# EAGLE design SparkFun_Qwiic_Motor_Driver (EAGLE 9.5.0)
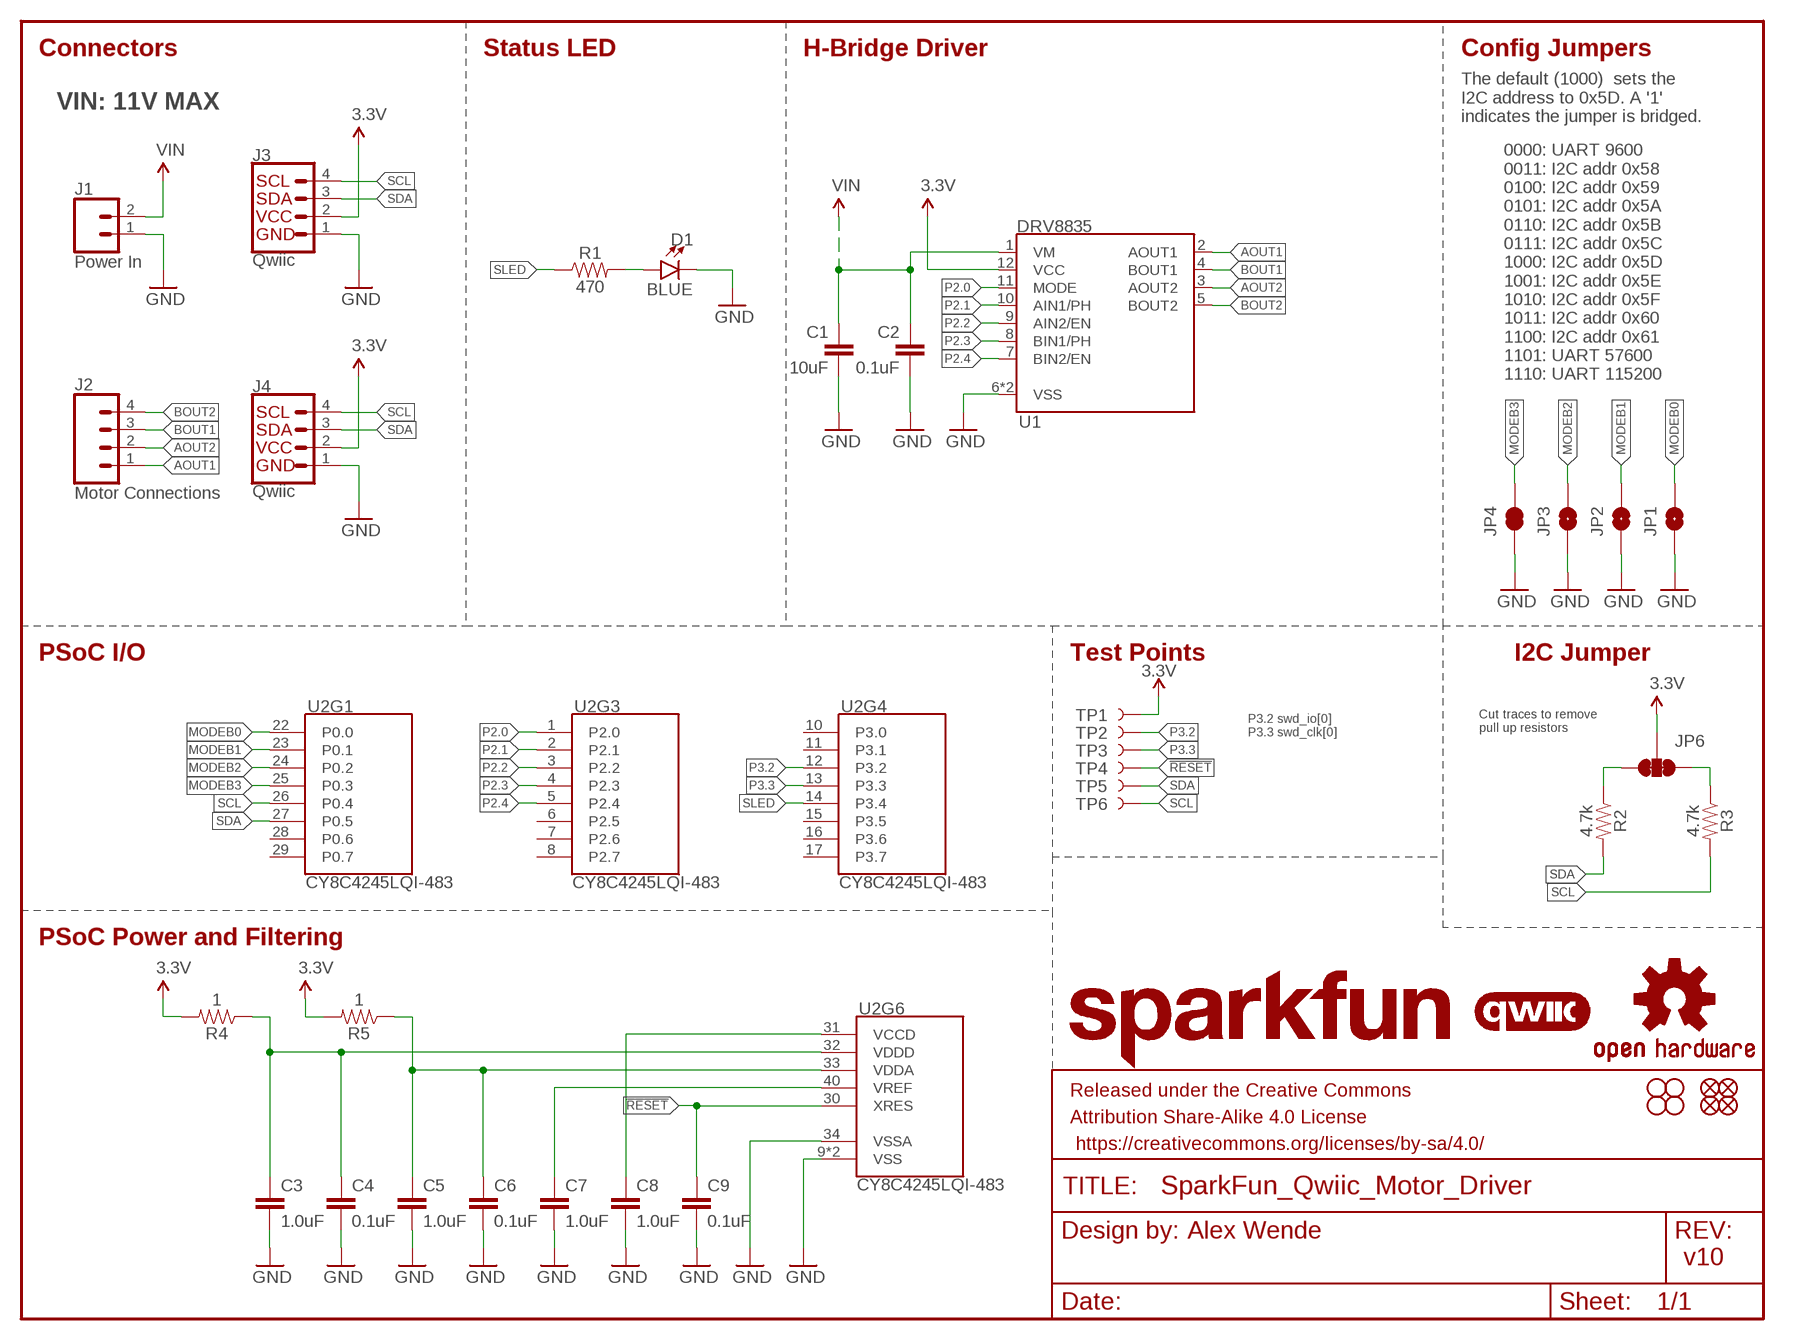
[diagram p0: schematic, sheet 1]

## Parts
C1  10uF  10UF-0805-25V-10%  [0805]
C2  0.1uF  0.1UF-0402-16V-10%  [0402]
C3  1.0uF  1.0UF-0402-16V-10%  [0402]
C4  0.1uF  0.1UF-0402-16V-10%  [0402]
C5  1.0uF  1.0UF-0402-16V-10%  [0402]
C6  0.1uF  0.1UF-0402-16V-10%  [0402]
C7  1.0uF  1.0UF-0402-16V-10%  [0402]
C8  1.0uF  1.0UF-0402-16V-10%  [0402]
C9  0.1uF  0.1UF-0402-16V-10%  [0402]
D1  BLUE  LED-BLUE0603  [LED-0603]
FD1  FIDUCIALUFIDUCIAL  [FIDUCIAL-MICRO]
FD2  FIDUCIALUFIDUCIAL  [FIDUCIAL-MICRO]
FD3  FIDUCIALUFIDUCIAL  [FIDUCIAL-MICRO]
FD4  FIDUCIALUFIDUCIAL  [FIDUCIAL-MICRO]
FRAME1  FRAME-LETTER  [CREATIVE_COMMONS]
H1  STAND-OFF  [STAND-OFF]
H2  STAND-OFF  [STAND-OFF]
H3  STAND-OFF  [STAND-OFF]
H4  STAND-OFF  [STAND-OFF]
J1  Power In  CONN_023.5MM  [SCREWTERMINAL-3.5MM-2]
J2  Motor Connections  CONN_04SCREW  [SCREWTERMINAL-3.5MM-4]
J3  Qwiic  QWIIC_CONNECTORJS-1MM  [JST04_1MM_RA]
J4  Qwiic  QWIIC_CONNECTORJS-1MM  [JST04_1MM_RA]
JP1  JUMPER-PAD-2  JUMPER-SMT_2_NO_NO-SILK  [SMT-JUMPER_2_NO_NO-SILK]
JP2  JUMPER-PAD-2  JUMPER-SMT_2_NO_NO-SILK  [SMT-JUMPER_2_NO_NO-SILK]
JP3  JUMPER-PAD-2  JUMPER-SMT_2_NO_NO-SILK  [SMT-JUMPER_2_NO_NO-SILK]
JP4  JUMPER-PAD-2  JUMPER-SMT_2_NC_TRACE_NO-SILK  [SMT-JUMPER_2_NC_TRACE_NO-SILK]
JP6  JUMPER-SMT_3_2-NC_TRACE_NO-SILK  [SMT-JUMPER_3_2-NC_TRACE_NO-SILK]
LOGO2  OSHW-LOGOMINI  [OSHW-LOGO-MINI]
LOGO3  SFE_LOGO_NAME.1_INCH  [SFE_LOGO_NAME_.1]
R1  470  470OHM-0603-1/10W-1%  [0603]
R2  4.7k  4.7KOHM-0603-1/10W-1%  [0603]
R3  4.7k  4.7KOHM-0603-1/10W-1%  [0603]
R4  1  1OHM-0603-1/10W-1%  [0603]
R5  1  1OHM-0603-1/10W-1%  [0603]
TP1  TEST-POINTTP_15TH_THRU  [TP_15TH]
TP2  TEST-POINTTP_15TH_THRU  [TP_15TH]
TP3  TEST-POINTTP_15TH_THRU  [TP_15TH]
TP4  TEST-POINTTP_15TH_THRU  [TP_15TH]
TP5  TEST-POINTTP_15TH_THRU  [TP_15TH]
TP6  TEST-POINTTP_15TH_THRU  [TP_15TH]
U1  DRV8835  DRV883X  [WSON-12]
U2  CY8C4245LQI-483  PSOC4_4200_40QFN  [QFN-40]
U$1  QWIIC_LOGO_5MM  [QWIIC_5MM]

## Nets
3.3V: J3.2 J4.2 JP6.2 R4.2 R5.2 TP1.P$1 U1.12(VCC)
!RESET: C9.1 TP4.P$1 U2.30(XRES)
AOUT1: J2.1 U1.2(AOUT1)
AOUT2: J2.2 U1.3(AOUT2)
BOUT1: J2.3 U1.4(BOUT1)
BOUT2: J2.4 U1.5(BOUT2)
GND: C1.2 C2.2 C3.2 C4.2 C5.2 C6.2 C7.2 C8.2 C9.2 D1.C J1.1 J3.1 J4.1 JP1.1 JP2.1 JP3.1 JP4.1 U1.6(VSS) U1.PAD(VSS) U2.9(VSS) U2.34(VSSA) U2.EP(VSS)
MODEB0: JP1.2 U2.22(P0.0)
MODEB1: JP2.2 U2.23(P0.1)
MODEB2: JP3.2 U2.24(P0.2)
MODEB3: JP4.2 U2.25(P0.3)
N$1: C8.1 U2.31(VCCD)
N$3: C5.1 C6.1 R5.1 U2.33(VDDA)
N$4: C7.1 U2.40(VREF)
N$10: D1.A R1.2
N$11: JP6.1 R3.1
N$12: JP6.3 R2.1
P2.0: U1.11(MODE) U2.1(P2.0)
P2.1: U1.10(AIN1/PH) U2.2(P2.1)
P2.2: U1.9(AIN2/EN) U2.3(P2.2)
P2.3: U1.8(BIN1/PH) U2.4(P2.3)
P2.4: U1.7(BIN2/EN) U2.5(P2.4)
P3.2: TP2.P$1 U2.12(P3.2)
P3.3: TP3.P$1 U2.13(P3.3)
SCL: J3.4 J4.4 R3.2 TP6.P$1 U2.26(P0.4)
SDA: J3.3 J4.3 R2.2 TP5.P$1 U2.27(P0.5)
SLED: R1.1 U2.14(P3.4)
VDDD: C3.1 C4.1 R4.1 U2.32(VDDD)
VIN: C1.1 C2.1 J1.2 U1.1(VM)
Unconnected: U2.6(P2.5) U2.7(P2.6) U2.8(P2.7) U2.10(P3.0) U2.11(P3.1) U2.15(P3.5) U2.16(P3.6) U2.17(P3.7) U2.18(P4.0) U2.19(P4.1) U2.20(P4.2) U2.21(P4.3) U2.28(P0.6) U2.29(P0.7) U2.35(P1.0) U2.36(P1.1) U2.37(P1.2) U2.38(P1.3) U2.39(P1.4)

## Notes on the sheet
- Connectors | Status LED | H-Bridge Driver | Config Jumpers
- The default (1000)  sets the 
  I2C address to 0x5D. A '1' 
  indicates the jumper is bridged.
- VIN: 11V MAX
- 0000: UART 9600
  0011: I2C addr 0x58
  0100: I2C addr 0x59
  0101: I2C addr 0x5A
  0110: I2C addr 0x5B
  0111: I2C addr 0x5C
  1000: I2C addr 0x5D
  1001: I2C addr 0x5E
  1010: I2C addr 0x5F
  1011: I2C addr 0x60
  1100: I2C addr 0x61
  1101: UART 57600
  1110: UART 115200
- PSoC I/O | Test Points | I2C Jumper
- P3.2 swd_io[0]
  P3.3 swd_clk[0]
- Cut traces to remove
  pull up resistors
- PSoC Power and Filtering
- Alex Wende
- v10

## Library data of the parts
C1 = SparkFun-Capacitors:10UF: 10.0µF ceramic capacitors A capacitor is a passive two-terminal electrical component used to store electrical energy temporarily in an electric field.; PROD_ID: CAP-14259
C2 C4 C6 C9 = SparkFun-Capacitors:0.1UF: 0.1µF ceramic capacitors A capacitor is a passive two-terminal electrical component used to store electrical energy temporarily in an electric field.; PROD_ID: CAP-12416
C3 C5 C7 C8 = SparkFun-Capacitors:1.0UF: 1µF ceramic capacitors A capacitor is a passive two-terminal electrical component used to store electrical energy temporarily in an electric field.; PROD_ID: CAP-12417
D1 = SparkFun-LED:LED-BLUE: Blue SMD LED Used in manufacturing of various products at SparkFun Packages: 0603 - SMD 0603 package [Product Link] <http://www.digikey.com/product-detail/en/SMLE12BC7TT86/511-1589-2-ND/1641808> 1206 - SMD1206 package [Product Link] <http://www.digikey.com/product-detail/en/lite-on-inc/LTST-C150TBKT/160-1643-1-ND/573584> SparkFun Products: ESP8266 Thing-Dev Board <https://www.sparkfun.com/products/13711> RedBoard <https://www.sparkfun.com/products/12757>; PROD_ID: DIO-08575
FD1-FD4 = SparkFun-Aesthetics:FIDUCIAL: Fiducial Alignment Points Point-of-reference for pick-and-place machines and other optical instruments.
FRAME1 = SparkFun-Aesthetics:FRAME-LETTER: Schematic Frame Standard 8.5x11 US Letter frame
H1-H4 = SparkFun-Hardware:STAND-OFF: Stand Off Drill holes for mechanically mounting via screws, standoffs, etc. Note: Use the keepout ring to avoid running the screw head into surrounding components. Variant Overviews STAND-OFF - Mechanical footprint for a #4 phillips button head screw. STAND-OFF-TIGHT - Mechanical footprint for a #4 phillips button head screw, Example SparkFun Products Screw - Phillips Head (1/4", 4-40, 10 pack) <https://www.sparkfun.com/products/10453> (PRT-10453) Screw - Phillips Head (1/2", 4-40, 10 pack) <https://www.sparkfun.com/products/10452> (PRT-10452) Screw - Phillips Head (3/4", 4-40, 10 pack) <https://www.sparkfun.com/products/10451> (PRT-10451) Screw - Phillips Head (1", 4-40, 10 pack) <https://www.sparkfun.com/products/10450> (PRT-10450)
J1 = SparkFun-Connectors:CONN_02: Multi connection point. Often used as Generic Header-pin footprint for 0.1 inch spaced/style header connections On any of the 0.1 inch spaced packages, you can populate with these: Break Away Headers - Straight <https://www.sparkfun.com/products/116> (PRT-00116) Break Away Male Headers - Right Angle <https://www.sparkfun.com/products/553> (PRT-00553) Female Headers <https://www.sparkfun.com/products/115> (PRT-00115) Break Away Headers - Machine Pin <https://www.sparkfun.com/products/117> (PRT-00117) Break Away Female Headers - Swiss Machine Pin <https://www.sparkfun.com/products/743> (PRT-00743) For SCREWTERMINALS and SPRING TERMINALS visit here: Screw Terimnals on SparkFun.com <https://www.sparkfun.com/search/results?term=Screw+Terminals> (5mm/3.5mm/2.54mm spacing) This device is also useful as a general connection point to wire up your design to another part of your project. Our various solder wires solder well into these plated through hole pads. Hook-Up Wire - Assortment (Stranded, 22 AWG) <https://www.sparkfun.com/products/11375> (PRT-11375) Hook-Up Wire - Assortment (Solid Core, 22 AWG) <https://www.sparkfun.com/products/11367> (PRT-11367) View the entire wire category on our website here <https://www.sparkfun.com/categories/141> Special notes: Molex polarized connector foot print use with: PRT-08233 with associated crimp pins and housings. 2.54_SCREWTERM for use with PRT-10571. 3.5mm Screw Terminal footprints for PRT-08084 5mm Screw Terminal footprints for use with PRT-08432; PROD_ID: CONN-08399
J2 = SparkFun-Connectors:CONN_04: Multi connection point. Often used as Generic Header-pin footprint for 0.1 inch spaced/style header connections On any of the 0.1 inch spaced packages, you can populate with these: Break Away Headers - Straight <https://www.sparkfun.com/products/116> (PRT-00116) Break Away Male Headers - Right Angle <https://www.sparkfun.com/products/553> (PRT-00553) Female Headers <https://www.sparkfun.com/products/115> (PRT-00115) Break Away Headers - Machine Pin <https://www.sparkfun.com/products/117> (PRT-00117) Break Away Female Headers - Swiss Machine Pin <https://www.sparkfun.com/products/743> (PRT-00743) For SCREWTERMINALS and SPRING TERMINALS visit here: Screw Terimnals on SparkFun.com <https://www.sparkfun.com/search/results?term=Screw+Terminals> (5mm/3.5mm/2.54mm spacing) This device is also useful as a general connection point to wire up your design to another part of your project. Our various solder wires solder well into these plated through hole pads. Hook-Up Wire - Assortment (Stranded, 22 AWG) <https://www.sparkfun.com/products/11375> (PRT-11375) Hook-Up Wire - Assortment (Solid Core, 22 AWG) <https://www.sparkfun.com/products/11367> (PRT-11367) View the entire wire category on our website here <https://www.sparkfun.com/categories/141> Special notes: Molex polarized connector foot print use with SKU : PRT-08231 with associated crimp pins and housings. 1MM SMD Version SKU: PRT-10208; PROD_ID: CONN-14485
J3 J4 = SparkFun-Connectors:QWIIC_CONNECTOR: SparkFun I2C Standard Qwiic Connector An SMD 1mm pitch JST connector makes it easy and quick (get it? Qwiic?) to connect I2C devices to each other. The Qwiic system <http://www.sparkfun.com/qwiic> enables fast and solderless connection between popular platforms and various sensors and actuators. We carry 200mm <https://www.sparkfun.com/products/14204>, 100mm <https://www.sparkfun.com/products/14205>, 50mm <https://www.sparkfun.com/products/14206>, and breadboard friendly <https://www.sparkfun.com/products/14207> Qwiic cables. We also offer 10 pcs strips <https://www.sparkfun.com/products/14323> the SMD connectors.; PROD_ID: CONN-13694
JP1-JP3 = SparkFun-Jumpers:JUMPER-SMT_2_NO: Normally open jumper This jumper has two pads in close proximity to each other. Apply solder to close the connection. Round pads are easier to solder for beginners, but are a lot larger. SparkFun Product that uses the round pads: SparkFun EL Sequencer <https://www.sparkfun.com/products/12781>
JP4 = SparkFun-Jumpers:JUMPER-SMT_2_NC_TRACE: Normally closed trace jumper This jumper has a trace between two pads so it's normally closed (NC). Use a razor knife to open the connection. For best results follow the IPC guidelines for cutting traces: Cutout at least 0.063 mm (0.005 in). Remove all loose material to clean up the cut area. Seal the cut with an approved epoxy. Reapply solder to reclose the connection.
JP6 = SparkFun-Jumpers:JUMPER-SMT_3_2-NC_TRACE: Normally closed trace jumper (2 of 2 connections) This jumper has a trace between all three pads so they are normally closed (NC). Use a razor knife to open the connection(s). For best results follow the IPC guidelines for cutting traces: Cutout at least 0.063 mm (0.005 in). Remove all loose material to clean up the cut area. Seal the cut with an approved epoxy. Reapply solder to reclose the connection(s).
LOGO2 = SparkFun-Aesthetics:OSHW-LOGO: Open Source Hardware Logo This logo indicates the piece of hardware it is found on incorporates a OSHW license and/or adheres to the definition of open source hardware found here: http://freedomdefined.org/OSHW
LOGO3 = SparkFun-Aesthetics:SFE_LOGO_NAME: SparkFun Font Logo This is the SparkFun name logo. The logo on the schematic will always be the same size; the package variant is the height of the flame part of the logo (or the height the flame would be, if it were drawn). Default layer for the logo on the board is tSilk.
R1 = SparkFun-Resistors:470OHM: 470Ω resistor A resistor is a passive two-terminal electrical component that implements electrical resistance as a circuit element. Resistors act to reduce current flow, and, at the same time, act to lower voltage levels within circuits.; PROD_ID: RES-07869
R2 R3 = SparkFun-Resistors:4.7KOHM: 4.7kΩ resistor A resistor is a passive two-terminal electrical component that implements electrical resistance as a circuit element. Resistors act to reduce current flow, and, at the same time, act to lower voltage levels within circuits.; PROD_ID: RES-07857
R4 R5 = SparkFun-Resistors:1OHM: 1Ω resistor A resistor is a passive two-terminal electrical component that implements electrical resistance as a circuit element. Resistors act to reduce current flow, and, at the same time, act to lower voltage levels within circuits.; PROD_ID: RES-08269
TP1-TP6 = SparkFun-Connectors:TEST-POINT: SparkFun Test Points Bare copper test points for troubleshooting or In-Circuit-Testing. These are used by our Production team for verifying production board runs using pogo-pins on test beds. SparkFun Products: SparkFun LSM9DS1 Breakout <https://www.sparkfun.com/products/13284> SparkFun PSOC <https://www.sparkfun.com/products/13714> SparkFun Load Cell Amplifier <https://www.sparkfun.com/products/13879>
U1 = SparkFun-IC-Special-Function:DRV883X: DRV8835 2 Channel Motor Driver Dual 1.5A H-bridge, 2-11V Datasheet <http://www.ti.com/lit/ds/symlink/drv8835.pdf> SparkFun Products: SparkFun Serial Controlled Motor Driver <https://www.sparkfun.com/products/13911>; PROD_ID: IC-13342
U2 = SparkFun-IC-Microcontroller:PSOC4_4200_40QFN: Cypress PSoC 4200 32-bit MCU 48-MHz ARM Cortex-M0 Datasheet <http://www.cypress.com/file/138656/download> SparkFun Products: SparkFun serial Controlled Motor Driver <https://www.sparkfun.com/products/13911>; PROD_ID: IC-13292
U$1 = SparkFun-Aesthetics:QWIIC_LOGO: Qwiic Logos for placement on schematic and PCB. The 5.5mm silk logo is best for placing next to Qwiic connector.

## Board
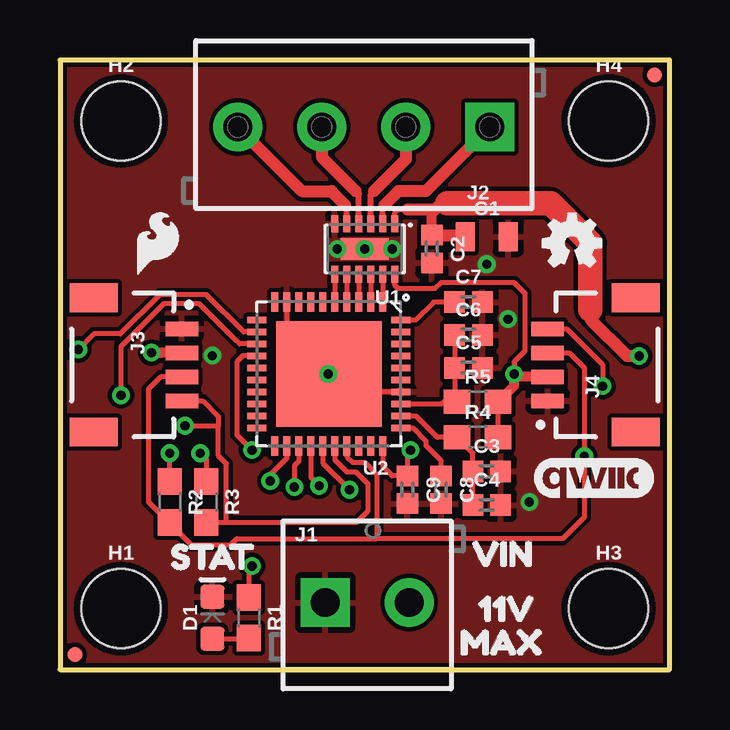
[diagram p1: board, top side]
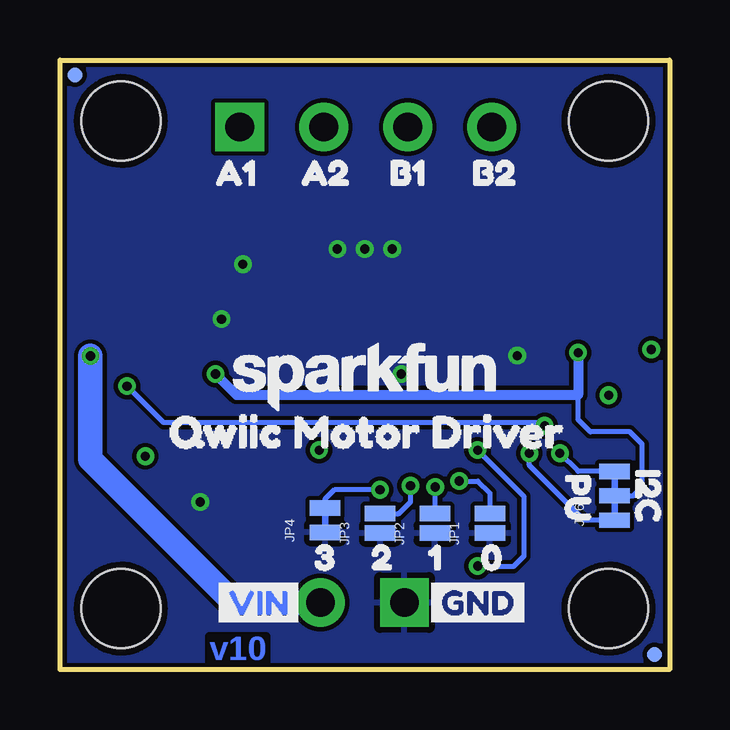
[diagram p2: board, bottom side, seen from below]

Size 25.4 x 25.4 mm. Coordinates in mm from the lower left corner, seen from the top.
Outline: 0,0 25.4,0 25.4,25.4 0,25.4 0,0
Copper layers (1*16): Top 0.035mm / dielectric 1.5mm / Bottom 0.035mm
Design rules "SparkFun-2-layer-TIGHT": minimum track width 7mil, minimum drill 15mil, track to track 7mil, track to pad 7mil, pad to pad 7mil, via to via 7mil, smd to smd 7mil, copper to edge 7mil, drill to drill 7mil, minimum pad ring 7mil, minimum via ring 7mil, stop-mask expansion 4mil, vias tented up to drill 25mil, thermal gap 10mil
tRestrict: 4 lines

### Footprints (pad centres in the part's own frame; a part is rotated, then mirrored left to right if it is on the bottom)
0805 = smd 0.8 x 1.2: 1 -0.9,0; 2 0.9,0
0402 = smd 0.85 x 0.9: 1 -0.58,0; 2 0.58,0
LED-0603 = smd 1 x 1: A -0.877,0; C 0.877,0
FIDUCIAL-MICRO = smd 0.635 x 0.635: 1 0,0
STAND-OFF = hole 3.302: 0,0
SCREWTERMINAL-3.5MM-2 = drill 1.2 pad 2.032 square: 1 0,0 | drill 1.2 pad 2.032: 2 3.5,0
SCREWTERMINAL-3.5MM-4 = drill 1.2 pad 2.032 square: 1 0,0 | drill 1.2 pad 2.032: 2 3.5,0; 3 7,0; 4 10.5,0
JST04_1MM_RA = smd 0.6 x 1.35: 1 -1.5,0; 2 -0.5,0; 3 0.5,0; 4 1.5,0 | smd 1.2 x 2: NC1 2.8,-3.675; NC2 -2.8,-3.675
SMT-JUMPER_2_NO_NO-SILK = smd 0.635 x 1.27: 1 -0.406,0; 2 0.406,0
SMT-JUMPER_2_NC_TRACE_NO-SILK = smd 0.635 x 1.27: 1 -0.508,0; 2 0.508,0
SMT-JUMPER_3_2-NC_TRACE_NO-SILK = smd 0.635 x 1.27: 1 -1.016,0; 2 0,0; 3 1.016,0
0603 = smd 1.1 x 1: 1 -0.85,0; 2 0.85,0
TP_15TH = drill 0.381 pad 0.61: P$1 0,0
WSON-12 = smd 0.3 x 0.7: 1 -1.25,-1.05; 2 -0.75,-1.05; 3 -0.25,-1.05; 4 0.25,-1.05; 5 0.75,-1.05; 6 1.25,-1.05; 7 1.25,1.05; 8 0.75,1.05; 9 0.25,1.05; 10 -0.25,1.05; 11 -0.75,1.05; 12 -1.25,1.05 | smd 2 x 0.9: PAD 0,0
QFN-40 = smd 0.285 x 0.8: 1 -2.25,-3; 2 -1.75,-3; 3 -1.25,-3; 4 -0.75,-3; 5 -0.25,-3; 6 0.25,-3; 7 0.75,-3; 8 1.25,-3; 9 1.75,-3; 10 2.25,-3; 21 2.25,3; 22 1.75,3; 23 1.25,3; 24 0.75,3; 25 0.25,3; 26 -0.25,3; 27 -0.75,3; 28 -1.25,3; 29 -1.75,3; 30 -2.25,3 | smd 0.8 x 0.285: 11 3,-2.25; 12 3,-1.75; 13 3,-1.25; 14 3,-0.75; 15 3,-0.25; 16 3,0.25; 17 3,0.75; 18 3,1.25; 19 3,1.75; 20 3,2.25; 31 -3,2.25; 32 -3,1.75; 33 -3,1.25; 34 -3,0.75; 35 -3,0.25; 36 -3,-0.25; 37 -3,-0.75; 38 -3,-1.25; 39 -3,-1.75; 40 -3,-2.25 | smd 4.4 x 4.4: EP 0,0

### Placement (x,y rotation side)
C1  17.78,18.03 0 top
C2  15.49,17.53 270 top
C3  17.78,8.26 0 top
C4  17.78,6.86 0 top
C5  17.02,12.57 0 top
C6  17.02,13.94 0 top
C7  17.02,15.32 0 top
C8  15.88,7.49 270 top
C9  14.48,7.49 270 top
D1  6.35,2.16 90 top
FD1  0.64,0.64 0 top
FD2  0.64,0.64 0 bottom
FD3  24.77,24.77 0 top
FD4  24.77,24.77 0 bottom
FRAME1  -7.75,-25.27 0 top  (outside the outline)
H1  2.54,2.54 0 top
H2  2.54,22.86 0 top
H3  22.86,2.54 0 top
H4  22.86,22.86 0 top
J1  11.05,2.79 0 top
J2  17.91,22.61 180 top
J3  5.08,12.7 270 top
J4  20.32,12.7 90 top
JP1  7.49,6.1 90 bottom
JP2  9.78,6.1 90 bottom
JP3  12.06,6.1 90 bottom
JP4  14.35,6.22 90 bottom
JP6  2.29,7.24 90 bottom
LOGO2  21.34,17.78 0 top
LOGO3  12.7,12.19 0 bottom
R1  7.87,2.16 270 top
R2  4.57,6.99 270 top
R3  6.1,6.99 270 top
R4  17.4,9.68 0 top
R5  17.4,11.15 0 top
TP1  3.81,13.21 0 top
TP2  0.76,13.34 0 top
TP3  2.54,11.43 0 top
TP4  14.61,9.14 0 top
TP5  21.84,8.89 0 top
TP6  22.61,11.81 0 top
U1  12.7,17.53 180 top
U2  11.2,12.32 180 top
U$1  22.23,8 0 top
U$2  [STAT4]  3.68,4.7 0 top
U$3  [GND3]  10.41,2.79 0 bottom
U$4  [VIN2]  19.3,2.79 0 bottom
U$5  [05]  8.76,4.67 0 bottom
U$6  [16]  11.18,4.67 0 bottom
U$7  [27]  13.34,4.67 0 bottom
U$8  [38]  15.88,4.67 0 bottom
U$9  [A110]  19.81,20.7 0 bottom
U$10  [A211]  16.26,20.7 0 bottom
U$11  [B112]  12.57,20.7 0 bottom
U$12  [B213]  9.14,20.7 0 bottom
U$13  [11V7]  16.51,2.54 0 top
U$14  [MAX8]  15.75,1.14 0 top
U$15  [VIN6]  16.26,4.83 0 top
U$16  [I2C0]  0.89,9.27 270 bottom
U$17  [PU1]  3.81,9.02 270 bottom
U$18  [QWIIC_MOTOR_DRIVER0]  21.97,9.91 0 bottom
U$19  [SFE_LOGO_FLAME_.1]  4.06,17.78 0 top

### Tracks (layer width: path | path; a pad name or v marks a point on that pad's centre or on a via)
3.3V  (via drill 0.38)
  Top 0.203: U1.12 13.95,16.02 14.1,15.88 15.62,15.88 15.88,16.13 18.92,16.13 19.37,15.69 19.37,13.27 18.92,12.83 v18.92,12.32 | R5.2 R4.2
  Top 0.406: J3.2 4.2,13.2 4.19,13.21 TP1.P$1 | J4.2 19.04,12.2 v18.92,12.32 18.92,11.82 R5.2
  Bottom 0.203: JP6.2 1.52,7.24 1.14,7.62 1.14,9.4 1.65,9.91 3.3,9.91 3.81,10.41 3.81,11.44
  Bottom 0.406: v18.92,12.32 18.05,11.44 3.81,11.44 TP1.P$1
!RESET
  Top 0.203: TP4.P$1 14.48,9.02 C9.1 13.84,8.07 13.45,8.46 U2.30
AOUT1
  Top 0.254: U1.2 13.45,19.29 13.53,19.37
  Top 0.508: 13.53,19.37 14.1,19.94 15.24,19.94 J2.1
AOUT2
  Top 0.254: U1.3 12.95,19.81 13.08,19.94
  Top 0.508: 13.08,19.94 14.41,21.27 J2.2
BOUT1
  Top 0.254: U1.4 12.45,19.81 12.32,19.94
  Top 0.508: 12.32,19.94 11.05,21.21 10.91,21.35 J2.3
BOUT2
  Top 0.254: U1.5 11.95,19.29 11.87,19.37
  Top 0.508: 11.87,19.37 11.3,19.94 10.07,19.94 J2.4
GND  (via drill 0.38)
  Top 0.203: U2.34 11.93,11.57 v11.18,12.32 9.45,14.04 U2.9
  other vias: 19.56,6.99 12.7,17.53 13.84,17.53 11.56,17.53 18.67,14.61 17.78,16.89 6.35,13.08
  pour Top: 0,25.4 25.4,25.4 25.4,0 0,0
  pour Bottom: 0,0 25.4,0 25.4,25.4 0,25.4
MODEB0  (via drill 0.38)
  Top 0.203: v8.76,7.86 8.76,8.13 9.45,8.82 U2.22
  Bottom 0.203: v8.76,7.86 7.98,7.86 7.49,7.37 JP1.2
MODEB1  (via drill 0.38)
  Top 0.203: v9.77,7.61 9.77,8.5 9.95,8.69 U2.23
  Bottom 0.203: v9.77,7.61 9.78,7.6 JP2.2
MODEB2  (via drill 0.38)
  Top 0.203: v10.79,7.66 10.45,8.01 U2.24
  Bottom 0.203: v10.79,7.66 10.79,6.99 11.28,6.5 JP3.2
MODEB3  (via drill 0.38)
  Top 0.203: v12.06,7.49 10.95,8.61 U2.25
  Bottom 0.203: v12.06,7.49 13.97,7.49 14.35,7.11 JP4.2
N$1
  Top 0.203: C8.1 15.88,8.71 15.24,9.34 15.24,9.53 14.7,10.07 U2.31
N$3
  Top 0.203: C6.1 C5.1 16.44,11.5 16.76,11.18 | 16.76,11.18 16,11.18 15.89,11.07 U2.33 | R5.1 16.79,11.15 16.76,11.18
N$4
  Top 0.203: C7.1 15.57,15.32 14.82,14.57 U2.40
N$10
  Top 0.203: D1.A 7.85,1.28 R1.2
N$11  (via drill 0.38)
  Top 0.203: v5.84,9.02 6.1,8.76 R3.1
  Bottom 0.203: v5.84,9.02 5.84,8.51 3.56,6.22 JP6.1
N$12  (via drill 0.38)
  Top 0.203: R2.1 v4.57,9.02
  Bottom 0.203: JP6.3 3.81,8.26 v4.57,9.02
P2.0
  Top 0.203: U1.11 U2.1
P2.1
  Top 0.203: U1.10 U2.2
P2.2
  Top 0.203: U1.9 U2.3
P2.3
  Top 0.203: U1.8 U2.4
P2.4
  Top 0.203: U1.7 U2.5
P3.2
  Top 0.203: TP2.P$1 1.41,13.99 2.52,13.99 4.16,15.62 6.1,15.62 7.65,14.07 U2.12
P3.3
  Top 0.203: TP3.P$1 2.54,13.46 4.32,15.24 5.81,15.24 7.35,13.7 7.48,13.57 U2.13
SCL  (via drill 0.38)
  Top 0.203: J4.4 21.11,14.2 22.61,12.7 TP6.P$1 | v5.21,10.16 6.6,10.16 | R3.2 6.93,6.13 | 6.93,6.13 12.36,6.13 12.83,6.6 12.83,7.75 12.33,8.24 11.95,8.24 11.45,8.74 U2.26 | J3.4 5.95,11.2 6.6,10.54 6.6,10.16 | 6.6,10.16 6.6,8.92 6.93,8.59 6.93,6.13
  Bottom 0.203: v5.21,10.16 5.33,10.29 21.08,10.29 TP6.P$1
SDA
  Top 0.203: 13.21,5.46 13.21,8.13 12.7,8.64 12.19,8.64 11.95,8.88 U2.27 | J4.3 21.22,13.2 21.84,12.57 TP5.P$1 21.84,6.35 20.95,5.46 13.21,5.46 | J3.3 4.2,12.2 3.68,11.68 3.68,6.99 4.57,6.1 | R2.2 4.57,6.1 | 4.57,6.1 5.46,5.21 7.11,5.21 7.37,5.46 13.21,5.46
SLED  (via drill 0.38)
  Top 0.203: v8,9.14 7.37,9.78 7.37,12.83 7.61,13.07 U2.14 | v8,4.32 8,4.28 7.87,4.15 R1.1
  Bottom 0.203: v8,4.32 7.97,4.29 6.51,4.29 6.07,4.72 6.07,7.21 v8,9.14
VDDD
  Top 0.203: C4.1 C3.1 17.2,9.02 16.76,9.45 16.76,9.68 R4.1 15.72,9.68 14.83,10.57 U2.32
VIN  (via drill 0.38)
  Top 0.203: U1.1 13.95,19.03 14.1,19.18 14.48,19.18
  Top 0.406: C2.1 15.49,19.05 15.49,19.18
  Top 0.508: C2.1 16.81,18.11 C1.1 | 14.48,19.18 15.49,19.18 | 22.1,14.99 22.1,14.61 23.64,13.07 v24.13,13.07 | 15.49,19.05 15.88,19.43 16.13,19.43
  Top 1.016: 22.1,14.99 22.1,17.78 20.45,19.43 16.13,19.43
  Bottom 1.016: J1.2 18.16,2.79 24.13,8.76 v24.13,13.07

### Text on the board
Bottom: v10
tDocu: Alex Wende